# EAGLE schematic Detailed Block Diagram (EAGLE 8.2.2)
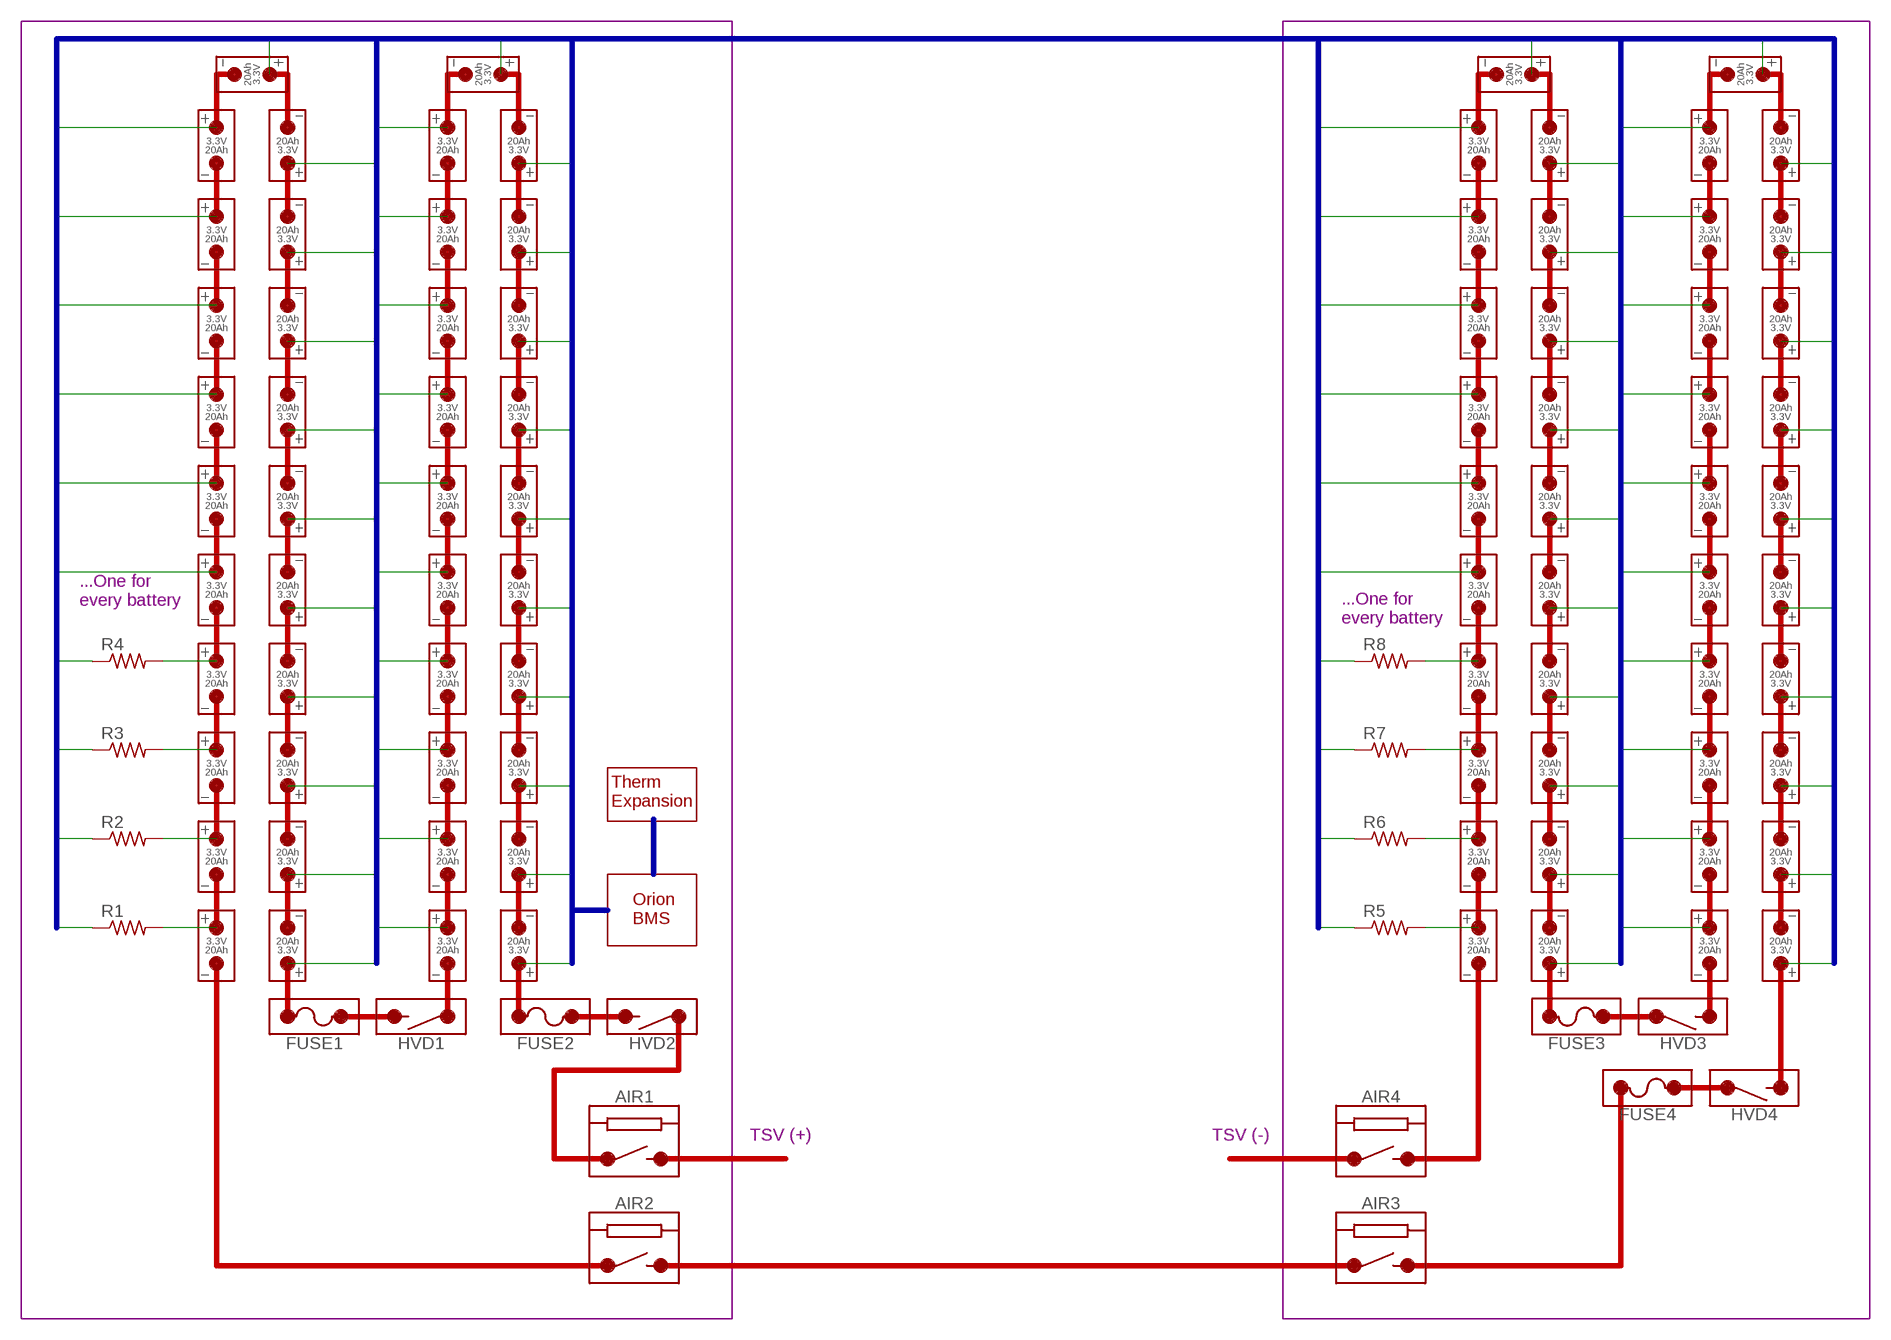
[diagram p0: schematic, sheet 1]

## Parts
AIR1  AIR  [AIR]
AIR2  AIR  [AIR]
AIR3  AIR  [AIR]
AIR4  AIR  [AIR]
FUSE1  FUSE  [FUSE]
FUSE2  FUSE  [FUSE]
FUSE3  FUSE  [FUSE]
FUSE4  FUSE  [FUSE]
HVD1  HVD  [HVD]
HVD2  HVD  [HVD]
HVD3  HVD  [HVD]
HVD4  HVD  [HVD]
R1  R-US_0817/22  [P0817/22]
R2  R-US_0817/22  [P0817/22]
R3  R-US_0817/22  [P0817/22]
R4  R-US_0817/22  [P0817/22]
R5  R-US_0817/22  [P0817/22]
R6  R-US_0817/22  [P0817/22]
R7  R-US_0817/22  [P0817/22]
R8  R-US_0817/22  [P0817/22]
U$1  BAT_CELL  [BAT_CELL]
U$2  BAT_CELL  [BAT_CELL]
U$3  BAT_CELL  [BAT_CELL]
U$4  BAT_CELL  [BAT_CELL]
U$5  BAT_CELL  [BAT_CELL]
U$6  BAT_CELL  [BAT_CELL]
U$7  BAT_CELL  [BAT_CELL]
U$8  BAT_CELL  [BAT_CELL]
U$9  BAT_CELL  [BAT_CELL]
U$10  BAT_CELL  [BAT_CELL]
U$11  BAT_CELL  [BAT_CELL]
U$12  BAT_CELL  [BAT_CELL]
U$13  BAT_CELL  [BAT_CELL]
U$14  BAT_CELL  [BAT_CELL]
U$15  BAT_CELL  [BAT_CELL]
U$16  BAT_CELL  [BAT_CELL]
U$17  BAT_CELL  [BAT_CELL]
U$18  BAT_CELL  [BAT_CELL]
U$19  BAT_CELL  [BAT_CELL]
U$20  BAT_CELL  [BAT_CELL]
U$21  BAT_CELL  [BAT_CELL]
U$22  BAT_CELL  [BAT_CELL]
U$23  BAT_CELL  [BAT_CELL]
U$24  BAT_CELL  [BAT_CELL]
U$25  BAT_CELL  [BAT_CELL]
U$26  BAT_CELL  [BAT_CELL]
U$27  BAT_CELL  [BAT_CELL]
U$28  BAT_CELL  [BAT_CELL]
U$29  BAT_CELL  [BAT_CELL]
U$30  BAT_CELL  [BAT_CELL]
U$31  BAT_CELL  [BAT_CELL]
U$32  BAT_CELL  [BAT_CELL]
U$33  BAT_CELL  [BAT_CELL]
U$34  BAT_CELL  [BAT_CELL]
U$35  BAT_CELL  [BAT_CELL]
U$36  BAT_CELL  [BAT_CELL]
U$37  BAT_CELL  [BAT_CELL]
U$38  BAT_CELL  [BAT_CELL]
U$39  BAT_CELL  [BAT_CELL]
U$40  BAT_CELL  [BAT_CELL]
U$41  BAT_CELL  [BAT_CELL]
U$42  BAT_CELL  [BAT_CELL]
U$43  BAT_CELL  [BAT_CELL]
U$44  BAT_CELL  [BAT_CELL]
U$45  BAT_CELL  [BAT_CELL]
U$46  BAT_CELL  [BAT_CELL]
U$47  BAT_CELL  [BAT_CELL]
U$48  BAT_CELL  [BAT_CELL]
U$49  BAT_CELL  [BAT_CELL]
U$50  BAT_CELL  [BAT_CELL]
U$51  BAT_CELL  [BAT_CELL]
U$52  BAT_CELL  [BAT_CELL]
U$53  BAT_CELL  [BAT_CELL]
U$54  BAT_CELL  [BAT_CELL]
U$55  BAT_CELL  [BAT_CELL]
U$56  BAT_CELL  [BAT_CELL]
U$57  BAT_CELL  [BAT_CELL]
U$58  BAT_CELL  [BAT_CELL]
U$59  BAT_CELL  [BAT_CELL]
U$60  BAT_CELL  [BAT_CELL]
U$61  BAT_CELL  [BAT_CELL]
U$62  BAT_CELL  [BAT_CELL]
U$63  BAT_CELL  [BAT_CELL]
U$64  BAT_CELL  [BAT_CELL]
U$65  BAT_CELL  [BAT_CELL]
U$66  BAT_CELL  [BAT_CELL]
U$67  BAT_CELL  [BAT_CELL]
U$68  BAT_CELL  [BAT_CELL]
U$69  BAT_CELL  [BAT_CELL]
U$70  BAT_CELL  [BAT_CELL]
U$71  BAT_CELL  [BAT_CELL]
U$72  BAT_CELL  [BAT_CELL]
U$73  BAT_CELL  [BAT_CELL]
U$74  BAT_CELL  [BAT_CELL]
U$75  BAT_CELL  [BAT_CELL]
U$76  BAT_CELL  [BAT_CELL]
U$77  BAT_CELL  [BAT_CELL]
U$78  BAT_CELL  [BAT_CELL]
U$79  BAT_CELL  [BAT_CELL]
U$80  BAT_CELL  [BAT_CELL]
U$81  BAT_CELL  [BAT_CELL]
U$82  BAT_CELL  [BAT_CELL]
U$83  BAT_CELL  [BAT_CELL]
U$84  BAT_CELL  [BAT_CELL]

## Nets
B$1: R1.1 R2.1 R3.1 R4.1 R5.1 R6.1 R7.1 R8.1 U$1.+ U$2.+ U$3.+ U$4.+ U$5.+ U$10.+ U$11.+ U$12.+ U$13.+ U$14.+ U$15.+ U$16.+ U$17.+ U$18.+ U$19.+ U$20.+ U$21.+ U$22.+ U$23.+ U$24.+ U$25.+ U$26.+ U$27.+ U$28.+ U$29.+ U$30.+ U$31.+ U$32.+ U$33.+ U$34.+ U$35.+ U$36.+ U$37.+ U$38.+ U$39.+ U$40.+ U$41.+ U$42.+ U$43.+ U$44.+ U$45.+ U$46.+ U$47.+ U$48.+ U$49.+ U$50.+ U$51.+ U$52.+ U$53.+ U$54.+ U$55.+ U$56.+ U$57.+ U$58.+ U$59.+ U$60.+ U$61.+ U$62.+ U$63.+ U$64.+ U$65.+ U$66.+ U$67.+ U$68.+ U$73.+ U$74.+ U$75.+ U$76.+ U$77.+ U$78.+ U$79.+ U$80.+ U$81.+ U$82.+ U$83.+ U$84.+
N$1: R1.2 U$9.+
N$2: R2.2 U$8.+
N$3: R3.2 U$7.+
N$4: R4.2 U$6.+
N$5: R5.2 U$72.+
N$6: R6.2 U$71.+
N$7: R7.2 U$70.+
N$8: R8.2 U$69.+
Unconnected: AIR1.P$1 AIR1.P$2 AIR1.P$3 AIR1.P$4 AIR2.P$1 AIR2.P$2 AIR2.P$3 AIR2.P$4 AIR3.P$1 AIR3.P$2 AIR3.P$3 AIR3.P$4 AIR4.P$1 AIR4.P$2 AIR4.P$3 AIR4.P$4 FUSE1.1 FUSE1.2 FUSE2.1 FUSE2.2 FUSE3.1 FUSE3.2 FUSE4.1 FUSE4.2 HVD1.P$1 HVD1.P$2 HVD2.P$1 HVD2.P$2 HVD3.P$1 HVD3.P$2 HVD4.P$1 HVD4.P$2 U$1.- U$2.- U$3.- U$4.- U$5.- U$6.- U$7.- U$8.- U$9.- U$10.- U$11.- U$12.- U$13.- U$14.- U$15.- U$16.- U$17.- U$18.- U$19.- U$20.- U$21.- U$22.- U$23.- U$24.- U$25.- U$26.- U$27.- U$28.- U$29.- U$30.- U$31.- U$32.- U$33.- U$34.- U$35.- U$36.- U$37.- U$38.- U$39.- U$40.- U$41.- U$42.- U$43.- U$44.- U$45.- U$46.- U$47.- U$48.- U$49.- U$50.- U$51.- U$52.- U$53.- U$54.- U$55.- U$56.- U$57.- U$58.- U$59.- U$60.- U$61.- U$62.- U$63.- U$64.- U$65.- U$66.- U$67.- U$68.- U$69.- U$70.- U$71.- U$72.- U$73.- U$74.- U$75.- U$76.- U$77.- U$78.- U$79.- U$80.- U$81.- U$82.- U$83.- U$84.-

## Buses
B$1
B$2

## Notes on the sheet
- ...One for
  every battery
- ...One for
  every battery
- Therm
  Expansion
- Orion
  BMS
- TSV (+) | TSV (-)

## Library data of the parts
AIR1-AIR4 = Custom Block Diagram Parts:AIR
FUSE1-FUSE4 = Custom Block Diagram Parts:FUSE
HVD1-HVD4 = Custom Block Diagram Parts:HVD
R1-R8 = resistor:R-US_: RESISTOR, American symbol
U$1-U$84 = Custom Block Diagram Parts:BAT_CELL